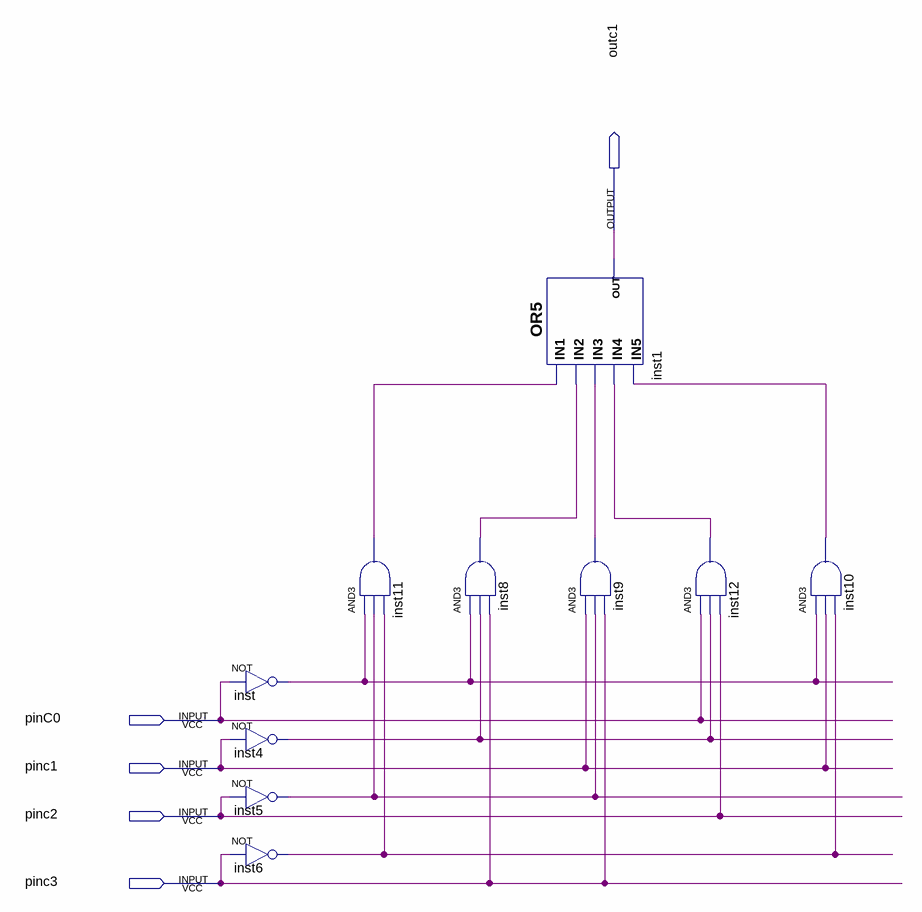
[diagram p0: schematic sheet]
// Quartus schematic OriginalC.bdf as structural Verilog: 10 symbols, 5 pins
module OriginalC (
  input  pinC0,
  input  pinc1,
  input  pinc2,
  input  pinc3,
  output outc1
);

  wire inst4_out, inst5_out, inst6_out, inst8_out, inst9_out, inst10_out, inst11_out, inst12_out, inst_out;

  not inst (inst_out, pinC0);
  not inst4 (inst4_out, pinc1);
  not inst5 (inst5_out, pinc2);
  not inst6 (inst6_out, pinc3);
  and inst11 (inst11_out, inst_out, inst5_out, inst6_out);
  and inst8 (inst8_out, inst_out, inst4_out, pinc3);
  or inst1 (outc1, inst11_out, inst8_out, inst9_out, inst12_out, inst10_out);
  and inst9 (inst9_out, pinc1, inst5_out, pinc3);
  and inst12 (inst12_out, pinC0, inst4_out, pinc2);
  and inst10 (inst10_out, inst_out, pinc1, inst6_out);
endmodule
